# Altium schematic sheet IDC_EXT_CPCIS_interconn_map.SchDoc
size 420 x 297 mm; DocumentNumber: 6; SheetNumber: 6; SheetTotal: 8; EDA_Number: ARTIQ; ModifiedBy: -; Title2: -; DivGrp: ISE; ModifiedDate: -
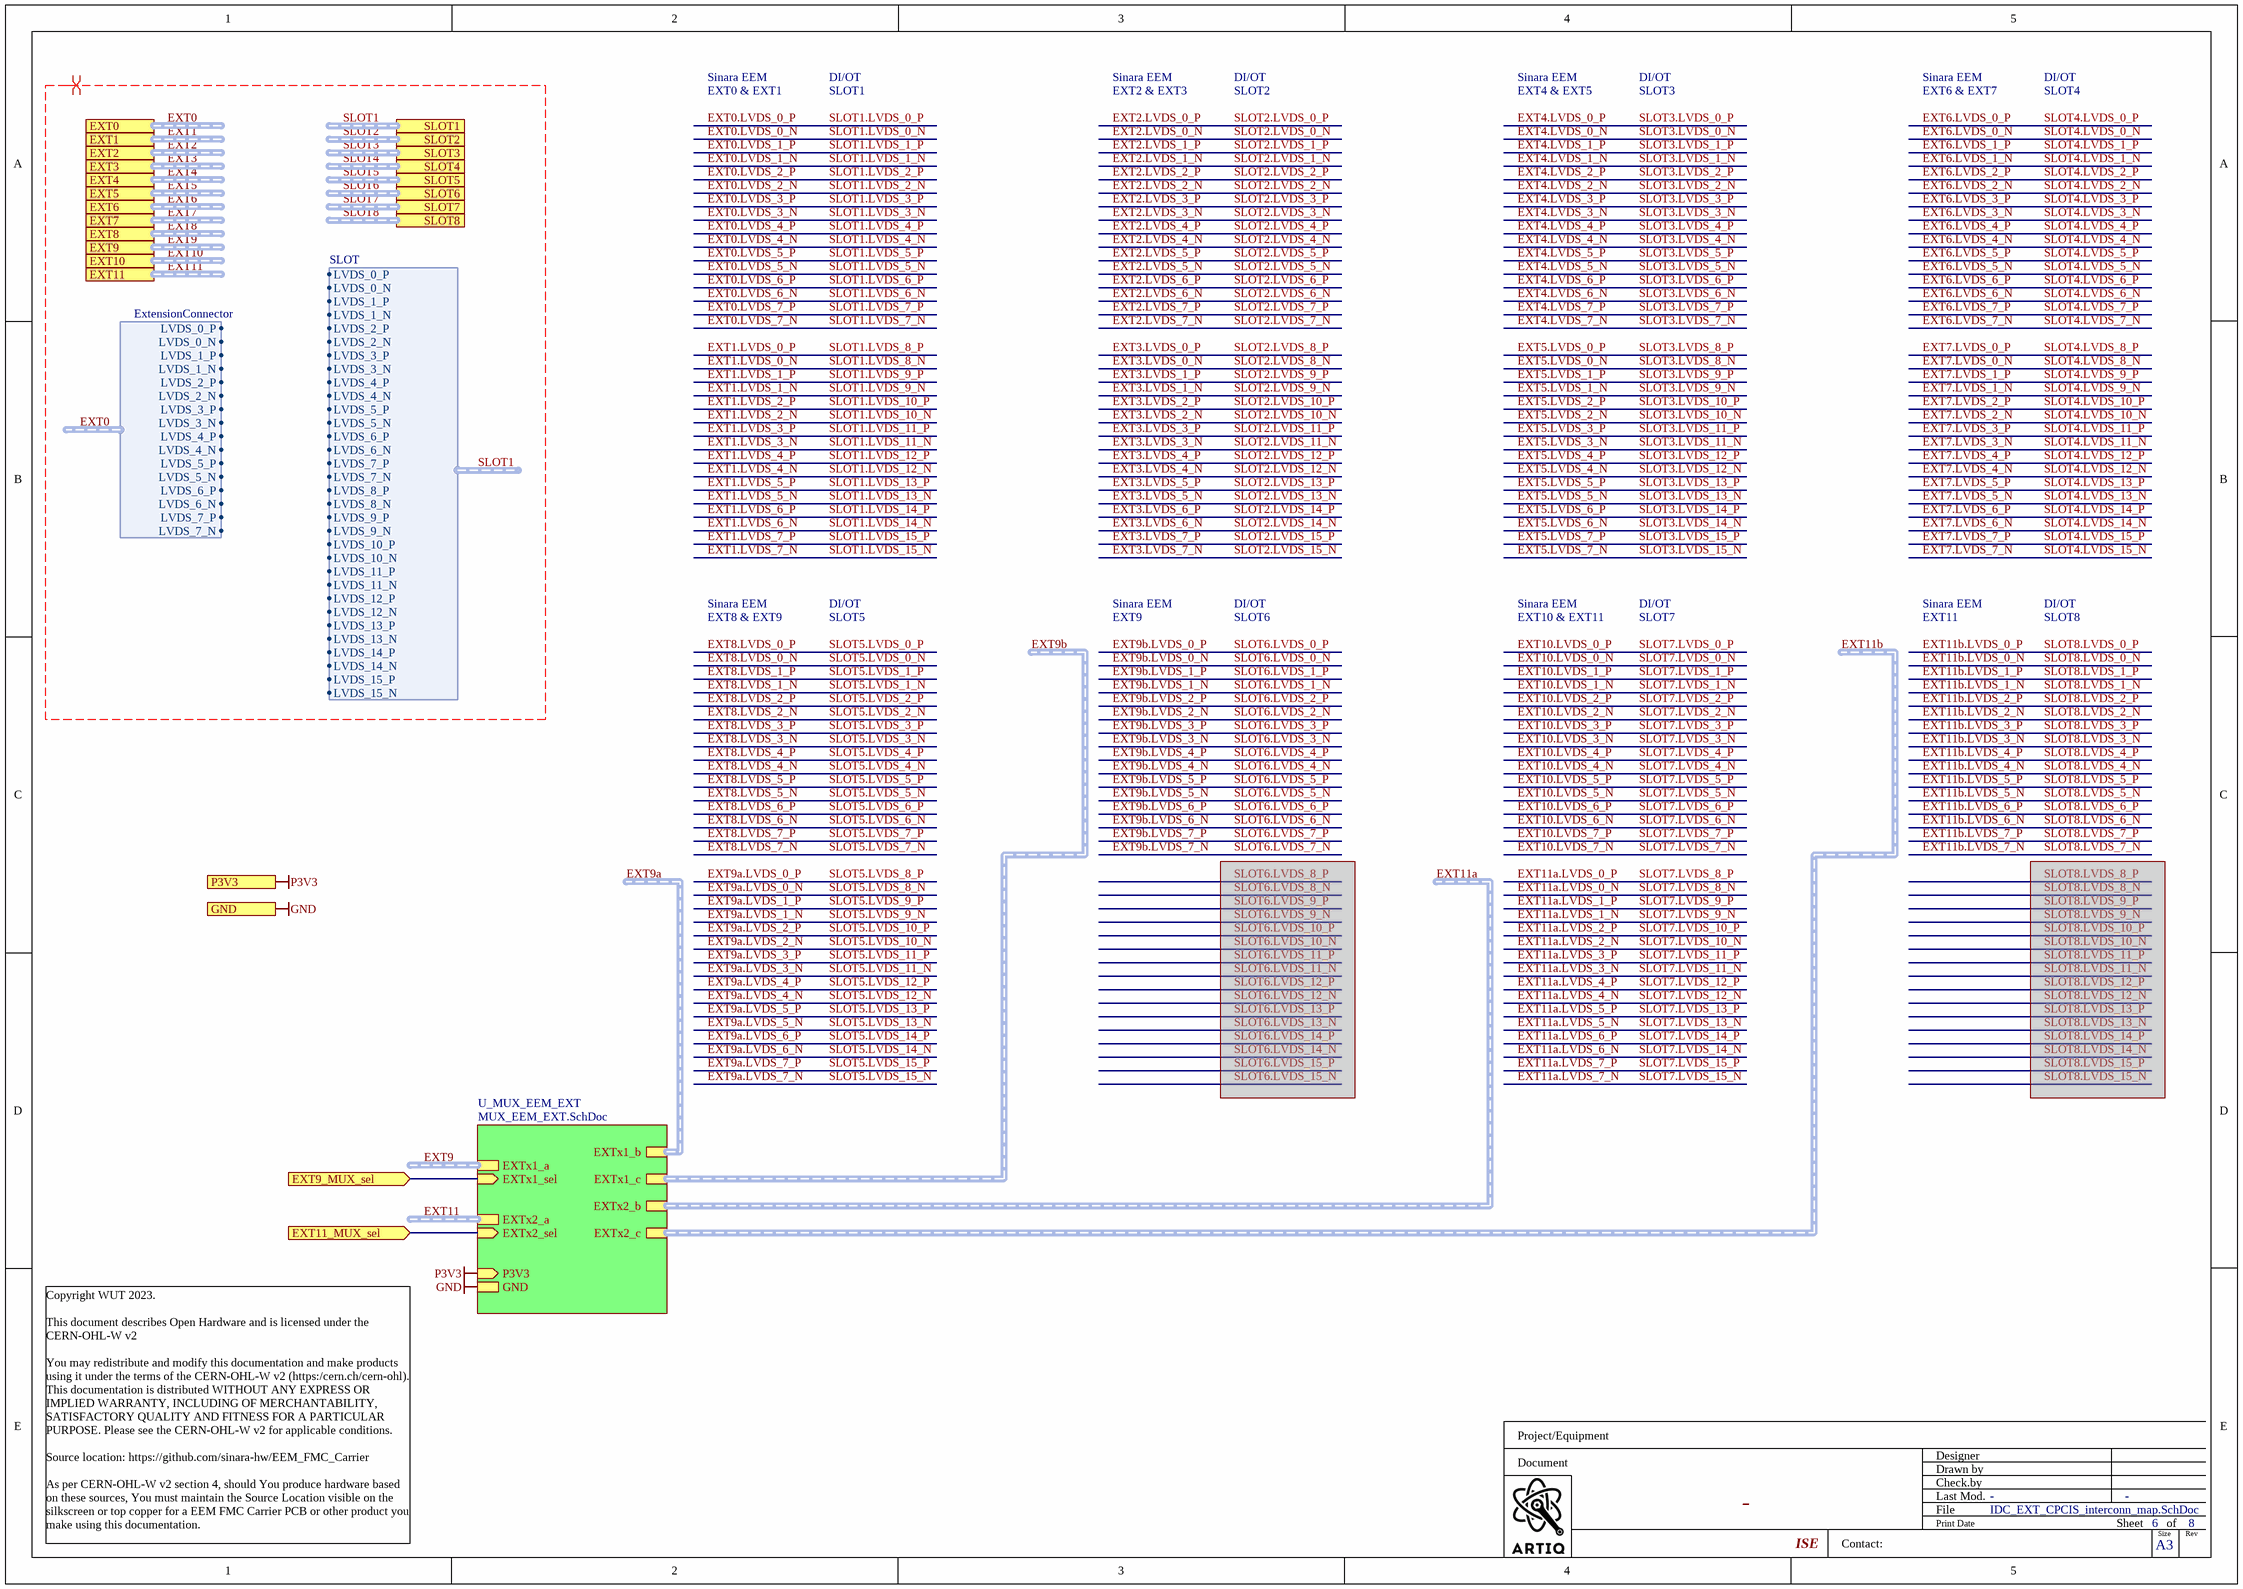
[diagram p0: IDC_EXT_CPCIS_interconn_map.SchDoc]

## Sub-sheets
U_MUX_EEM_EXT = MUX_EEM_EXT.SchDoc: EXTx1_a (harness ExtensionConnector), EXTx1_b (harness ExtensionConnector), EXTx1_c (harness ExtensionConnector), EXTx2_a (harness ExtensionConnector), EXTx2_b (harness ExtensionConnector), EXTx2_c (harness ExtensionConnector), GND, P3V3 (in), EXTx1_sel (in), EXTx2_sel (in)

## Ports
EXT0 (harness ExtensionConnector), EXT1 (harness ExtensionConnector), EXT2 (harness ExtensionConnector), EXT3 (harness ExtensionConnector), EXT4 (harness ExtensionConnector), EXT5 (harness ExtensionConnector), EXT6 (harness ExtensionConnector), EXT7 (harness ExtensionConnector), EXT8 (harness ExtensionConnector), EXT9 (harness ExtensionConnector), EXT9_MUX_sel (in), EXT10 (harness ExtensionConnector), EXT11 (harness ExtensionConnector), EXT11_MUX_sel (in), GND, P3V3 (in), SLOT1 (harness SLOT), SLOT2 (harness SLOT), SLOT3 (harness SLOT), SLOT4 (harness SLOT), SLOT5 (harness SLOT), SLOT6 (harness ExtensionConnector), SLOT7 (harness SLOT), SLOT8 (harness ExtensionConnector)

## Harnesses
ExtensionConnector: LVDS_0_N, LVDS_0_P, LVDS_1_N, LVDS_1_P, LVDS_2_N, LVDS_2_P, LVDS_3_N, LVDS_3_P, LVDS_4_N, LVDS_4_P, LVDS_5_N, LVDS_5_P, LVDS_6_N, LVDS_6_P, LVDS_7_N, LVDS_7_P
SLOT: LVDS_0_P, LVDS_0_N, LVDS_1_P, LVDS_1_N, LVDS_2_P, LVDS_2_N, LVDS_3_P, LVDS_3_N, LVDS_4_P, LVDS_4_N, LVDS_5_P, LVDS_5_N, LVDS_6_P, LVDS_6_N, LVDS_7_P, LVDS_7_N, LVDS_8_P, LVDS_8_N, LVDS_9_P, LVDS_9_N, LVDS_10_P, LVDS_10_N, LVDS_11_P, LVDS_11_N, LVDS_12_P, LVDS_12_N, LVDS_13_P, LVDS_13_N, LVDS_14_P, LVDS_14_N, LVDS_15_P, LVDS_15_N

## Nets
GND: port GND, sheet U_MUX_EEM_EXT/GND
P3V3: port P3V3, sheet U_MUX_EEM_EXT/P3V3
EXT9_MUX_sel: port EXT9_MUX_sel, sheet U_MUX_EEM_EXT/EXTx1_sel
EXT11_MUX_sel: port EXT11_MUX_sel, sheet U_MUX_EEM_EXT/EXTx2_sel

## Buses and harness runs
harness EXT0 = port EXT0
harness EXT1 = port EXT1
harness EXT2 = port EXT2
harness EXT3 = port EXT3
harness EXT4 = port EXT4
harness EXT5 = port EXT5
harness EXT6 = port EXT6
harness EXT7 = port EXT7
harness EXT8 = port EXT8
harness EXT9 = port EXT9
harness EXT9 = sheet U_MUX_EEM_EXT/EXTx1_a
harness EXT9a = sheet U_MUX_EEM_EXT/EXTx1_b
harness EXT9b = sheet U_MUX_EEM_EXT/EXTx1_c
harness EXT10 = port EXT10
harness EXT11 = port EXT11
harness EXT11 = sheet U_MUX_EEM_EXT/EXTx2_a
harness EXT11a = sheet U_MUX_EEM_EXT/EXTx2_b
harness EXT11b = sheet U_MUX_EEM_EXT/EXTx2_c
harness SLOT1 = port SLOT1
harness SLOT2 = port SLOT2
harness SLOT3 = port SLOT3
harness SLOT4 = port SLOT4
harness SLOT5 = port SLOT5
harness SLOT6 = port SLOT6
harness SLOT7 = port SLOT7
harness SLOT8 = port SLOT8

## Layout directives
differential pair: EXT0, EXT1, EXT2, EXT3, EXT4, EXT5, EXT6, EXT7, EXT8, EXT9, EXT10, EXT11, SLOT1, SLOT2, SLOT3, SLOT4, SLOT5, SLOT6, SLOT7, SLOT8

## Notes on the sheet
- EXT0 & EXT1
- Sinara EEM
- SLOT1
- DI/OT
- EXT2 & EXT3
- SLOT2
- EXT4 & EXT5
- SLOT3
- EXT6 & EXT7
- SLOT4
- EXT8 & EXT9
- SLOT5
- EXT9
- SLOT6
- EXT10 & EXT11
- SLOT7
- EXT11
- SLOT8
- Project/Equipment
- Document
- Designer
- Drawn by
- Check.by
- Copyright WUT 2023.
  This document describes Open Hardware and is licensed under the CERN-OHL-W v2
  You may redistribute and modify this documentation and make products using it under the terms of the CERN-OHL-W v2 (https:/cern.ch/cern-ohl). This documentation is distributed WITHOUT ANY EXPRESS OR IMPLIED WARRANTY, INCLUDING OF MERCHANTABILITY, SATISFACTORY QUALITY AND FITNESS FOR A PARTICULAR PURPOSE. Please see the CERN-OHL-W v2 for applicable conditions.
  Source location: https://github.com/sinara-hw/EEM_FMC_Carrier
  As per CERN-OHL-W v2 section 4, should You produce hardware based on these sources, You must maintain the Source Location visible on the silkscreen or top copper for a EEM FMC Carrier PCB or other product you make using this documentation.
- Contact:
- File
- Last Mod.
- Print Date
- Sheet
- Size
- A3
- of
- Rev